# EAGLE design USB Experiment Board (EAGLE 9.6.2)
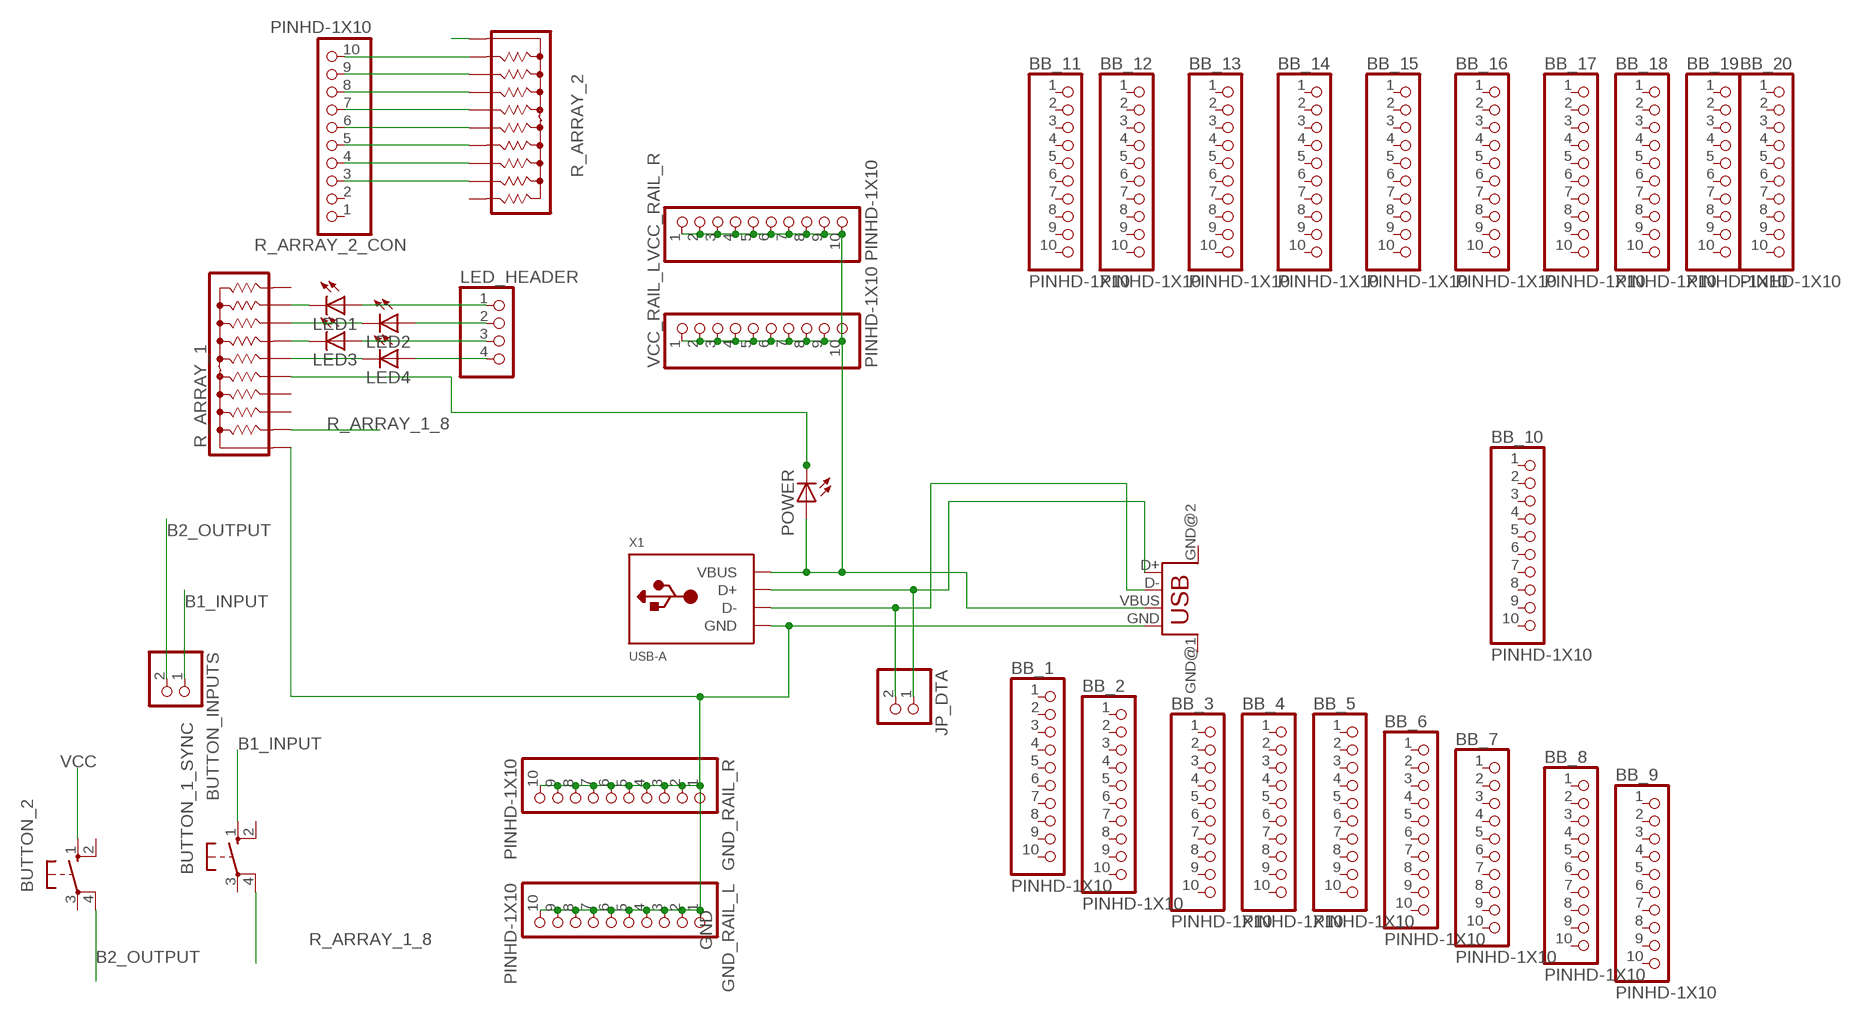
[diagram p0: schematic, sheet 1]

## Parts
BB_1  PINHD-1X10  [1X10-BIG]
BB_2  PINHD-1X10  [1X10-BIG]
BB_3  PINHD-1X10  [1X10-BIG]
BB_4  PINHD-1X10  [1X10-BIG]
BB_5  PINHD-1X10  [1X10-BIG]
BB_6  PINHD-1X10  [1X10-BIG]
BB_7  PINHD-1X10  [1X10-BIG]
BB_8  PINHD-1X10  [1X10-BIG]
BB_9  PINHD-1X10  [1X10-BIG]
BB_10  PINHD-1X10  [1X10-BIG]
BB_11  PINHD-1X10  [1X10-BIG]
BB_12  PINHD-1X10  [1X10-BIG]
BB_13  PINHD-1X10  [1X10-BIG]
BB_14  PINHD-1X10  [1X10-BIG]
BB_15  PINHD-1X10  [1X10-BIG]
BB_16  PINHD-1X10  [1X10-BIG]
BB_17  PINHD-1X10  [1X10-BIG]
BB_18  PINHD-1X10  [1X10-BIG]
BB_19  PINHD-1X10  [1X10-BIG]
BB_20  PINHD-1X10  [1X10-BIG]
BUTTON_1_SYNC  10-XX  [B3F-10XX]
BUTTON_2  10-XX  [B3F-10XX]
BUTTON_INPUTS  PINHD-1X2  [1X02]
GND_RAIL_L  PINHD-1X10  [1X10-BIG]
GND_RAIL_R  PINHD-1X10  [1X10-BIG]
JP_DTA  PINHD-1X2  [1X02]
LED1  LEDSMT1206  [1206]
LED2  LEDSMT1206  [1206]
LED3  LEDSMT1206  [1206]
LED4  LEDSMT1206  [1206]
LED_HEADER  PINHD-1X4  [1X04]
POWER  LEDSMT1206  [1206]
R_ARRAY_1  4610X  [SIP10]
R_ARRAY_2  4610X  [SIP10]
R_ARRAY_2_CON  PINHD-1X10  [1X10-BIG]
U$1  USB  [USB-FEMALE-A-PTH]
VCC_RAIL_L  PINHD-1X10  [1X10-BIG]
VCC_RAIL_R  PINHD-1X10  [1X10-BIG]
X1  USB-A  [MOLEX_480371000]

## Nets
B1_INPUT: BUTTON_1_SYNC.1(S) BUTTON_INPUTS.1
B2_OUTPUT: BUTTON_2.4(P1) BUTTON_INPUTS.2
GND: GND_RAIL_L.1 GND_RAIL_L.2 GND_RAIL_L.3 GND_RAIL_L.4 GND_RAIL_L.5 GND_RAIL_L.6 GND_RAIL_L.7 GND_RAIL_L.8 GND_RAIL_L.9 GND_RAIL_L.10 GND_RAIL_R.1 GND_RAIL_R.2 GND_RAIL_R.3 GND_RAIL_R.4 GND_RAIL_R.5 GND_RAIL_R.6 GND_RAIL_R.7 GND_RAIL_R.8 GND_RAIL_R.9 GND_RAIL_R.10 R_ARRAY_1.1 R_ARRAY_2.1 U$1.GND X1.4(GND)
N$1: R_ARRAY_2.2 R_ARRAY_2_CON.10
N$2: LED1.C R_ARRAY_1.9
N$3: JP_DTA.1 U$1.D+ X1.3(D+)
N$4: JP_DTA.2 U$1.D- X1.2(D-)
N$5: LED2.C R_ARRAY_1.8
N$6: LED3.C R_ARRAY_1.7
N$7: LED4.C R_ARRAY_1.6
N$8: LED1.A LED_HEADER.1
N$9: LED2.A LED_HEADER.2
N$10: LED3.A LED_HEADER.3
N$11: LED4.A LED_HEADER.4
N$12: R_ARRAY_2.3 R_ARRAY_2_CON.9
N$13: POWER.C R_ARRAY_1.5
N$14: R_ARRAY_2.4 R_ARRAY_2_CON.8
N$15: R_ARRAY_2.5 R_ARRAY_2_CON.7
N$16: R_ARRAY_2.6 R_ARRAY_2_CON.6
N$17: R_ARRAY_2.7 R_ARRAY_2_CON.5
N$18: R_ARRAY_2.8 R_ARRAY_2_CON.4
N$19: R_ARRAY_2.9 R_ARRAY_2_CON.3
R_ARRAY_1_8: BUTTON_1_SYNC.4(P1) R_ARRAY_1.2
VCC: BUTTON_2.1(S) POWER.A U$1.VBUS VCC_RAIL_L.1 VCC_RAIL_L.2 VCC_RAIL_L.3 VCC_RAIL_L.4 VCC_RAIL_L.5 VCC_RAIL_L.6 VCC_RAIL_L.7 VCC_RAIL_L.8 VCC_RAIL_L.9 VCC_RAIL_L.10 VCC_RAIL_R.1 VCC_RAIL_R.2 VCC_RAIL_R.3 VCC_RAIL_R.4 VCC_RAIL_R.5 VCC_RAIL_R.6 VCC_RAIL_R.7 VCC_RAIL_R.8 VCC_RAIL_R.9 VCC_RAIL_R.10 X1.1(VBUS)
Unconnected: BB_1.1 BB_1.2 BB_1.3 BB_1.4 BB_1.5 BB_1.6 BB_1.7 BB_1.8 BB_1.9 BB_1.10 BB_2.1 BB_2.2 BB_2.3 BB_2.4 BB_2.5 BB_2.6 BB_2.7 BB_2.8 BB_2.9 BB_2.10 BB_3.1 BB_3.2 BB_3.3 BB_3.4 BB_3.5 BB_3.6 BB_3.7 BB_3.8 BB_3.9 BB_3.10 BB_4.1 BB_4.2 BB_4.3 BB_4.4 BB_4.5 BB_4.6 BB_4.7 BB_4.8 BB_4.9 BB_4.10 BB_5.1 BB_5.2 BB_5.3 BB_5.4 BB_5.5 BB_5.6 BB_5.7 BB_5.8 BB_5.9 BB_5.10 BB_6.1 BB_6.2 BB_6.3 BB_6.4 BB_6.5 BB_6.6 BB_6.7 BB_6.8 BB_6.9 BB_6.10 BB_7.1 BB_7.2 BB_7.3 BB_7.4 BB_7.5 BB_7.6 BB_7.7 BB_7.8 BB_7.9 BB_7.10 BB_8.1 BB_8.2 BB_8.3 BB_8.4 BB_8.5 BB_8.6 BB_8.7 BB_8.8 BB_8.9 BB_8.10 BB_9.1 BB_9.2 BB_9.3 BB_9.4 BB_9.5 BB_9.6 BB_9.7 BB_9.8 BB_9.9 BB_9.10 BB_10.1 BB_10.2 BB_10.3 BB_10.4 BB_10.5 BB_10.6 BB_10.7 BB_10.8 BB_10.9 BB_10.10 BB_11.1 BB_11.2 BB_11.3 BB_11.4 BB_11.5 BB_11.6 BB_11.7 BB_11.8 BB_11.9 BB_11.10 BB_12.1 BB_12.2 BB_12.3 BB_12.4 BB_12.5 BB_12.6 BB_12.7 BB_12.8 BB_12.9 BB_12.10 BB_13.1 BB_13.2 BB_13.3 BB_13.4 BB_13.5 BB_13.6 BB_13.7 BB_13.8 BB_13.9 BB_13.10 BB_14.1 BB_14.2 BB_14.3 BB_14.4 BB_14.5 BB_14.6 BB_14.7 BB_14.8 BB_14.9 BB_14.10 BB_15.1 BB_15.2 BB_15.3 BB_15.4 BB_15.5 BB_15.6 BB_15.7 BB_15.8 BB_15.9 BB_15.10 BB_16.1 BB_16.2 BB_16.3 BB_16.4 BB_16.5 BB_16.6 BB_16.7 BB_16.8 BB_16.9 BB_16.10 BB_17.1 BB_17.2 BB_17.3 BB_17.4 BB_17.5 BB_17.6 BB_17.7 BB_17.8 BB_17.9 BB_17.10 BB_18.1 BB_18.2 BB_18.3 BB_18.4 BB_18.5 BB_18.6 BB_18.7 BB_18.8 BB_18.9 BB_18.10 BB_19.1 BB_19.2 BB_19.3 BB_19.4 BB_19.5 BB_19.6 BB_19.7 BB_19.8 BB_19.9 BB_19.10 BB_20.1 BB_20.2 BB_20.3 BB_20.4 BB_20.5 BB_20.6 BB_20.7 BB_20.8 BB_20.9 BB_20.10 BUTTON_1_SYNC.2(S1) BUTTON_1_SYNC.3(P) BUTTON_2.2(S1) BUTTON_2.3(P) R_ARRAY_1.3 R_ARRAY_1.4 R_ARRAY_1.10 R_ARRAY_2.10 R_ARRAY_2_CON.1 R_ARRAY_2_CON.2 U$1.GND@1(GND) U$1.GND@2(GND)

## Library data of the parts
BB_1-BB_20 GND_RAIL_L GND_RAIL_R R_ARRAY_2_CON VCC_RAIL_L VCC_RAIL_R = adafruit:PINHD-1X10: Pin header 1x10 0.1" spacing With round pins
BUTTON_1_SYNC BUTTON_2 = switch-omron:10-XX: OMRON SWITCH; MPN: B3F-1000; OC_FARNELL: 176432; OC_NEWARK: 36M3542
BUTTON_INPUTS JP_DTA = pinhead:PINHD-1X2: PIN HEADER
LED1-LED4 POWER = adafruit:LED: LED OSRAM: - CHIPLED LG R971, LG N971, LY N971, LG Q971, LY Q971, LO R971, LY R971 LH N974, LH R974 LS Q976, LO Q976, LY Q976 LO Q996 - Hyper CHIPLED LW Q18S LB Q993, LB Q99A, LB R99A - SideLED LS A670, LO A670, LY A670, LG A670, LP A670 LB A673, LV A673, LT A673, LW A673 LH A674 LY A675 LS A676, LA A676, LO A676, LY A676, LW A676 LS A679, LY A679, LG A679 - Hyper Micro SIDELED® LS Y876, LA Y876, LO Y876, LY Y876 LT Y87S - SmartLED LW L88C, LW L88S LB L89C, LB L89S, LG L890 LS L89K, LO L89K, LY L89K LS L896, LA L896, LO L896, LY L896 - TOPLED LS T670, LO T670, LY T670, LG T670, LP T670 LSG T670, LSP T670, LSY T670, LOP T670, LYG T670 LG T671, LOG T671, LSG T671 LB T673, LV T673, LT T673, LW T673 LH T674 LS T676, LA T676, LO T676, LY T676, LB T676, LH T676, LSB T676, LW T676 LB T67C, LV T67C, LT T67C, LS T67K, LO T67K, LY T67K, LW E67C LS E67B, LA E67B, LO E67B, LY E67B, LB E67C, LV E67C, LT E67C LW T67C LS T679, LY T679, LG T679 LS T770, LO T770, LY T770, LG T770, LP T770 LB T773, LV T773, LT T773, LW T773 LH T774 LS E675, LA E675, LY E675, LS T675 LS T776, LA T776, LO T776, LY T776, LB T776 LHGB T686 LT T68C, LB T68C - Hyper Mini TOPLED® LB M676 - Mini TOPLED Santana® LG M470 LS M47K, LO M47K, LY M47K Source: http://www.osram.convergy.de/
LED_HEADER = pinhead:PINHD-1X4: PIN HEADER
R_ARRAY_1 R_ARRAY_2 = resistor-sip:4610X: Bourns 4600X Series - Thick Film Conformal SIPs 4610X-101 Resistor Network Configuration: 101 (Bussed Resistors) Resistance range: 10 ohms to 10 Megaohms Maximum Operating Voltage: 100V Source: http://www.bourns.com/ProductLine.aspx?name=standard_thick_film_networks PDF: http://www.bourns.com/data/global/pdfs/4600X.pdf
U$1 = STUNTAZ:USB: USB Connectors USB-FEMALE-A-PTH: Through hole Female Type A Connector
X1 = adafruit:USB-A: USB type A 'plug' Used for things that can directly connect to a USB port, say USB key

## Board
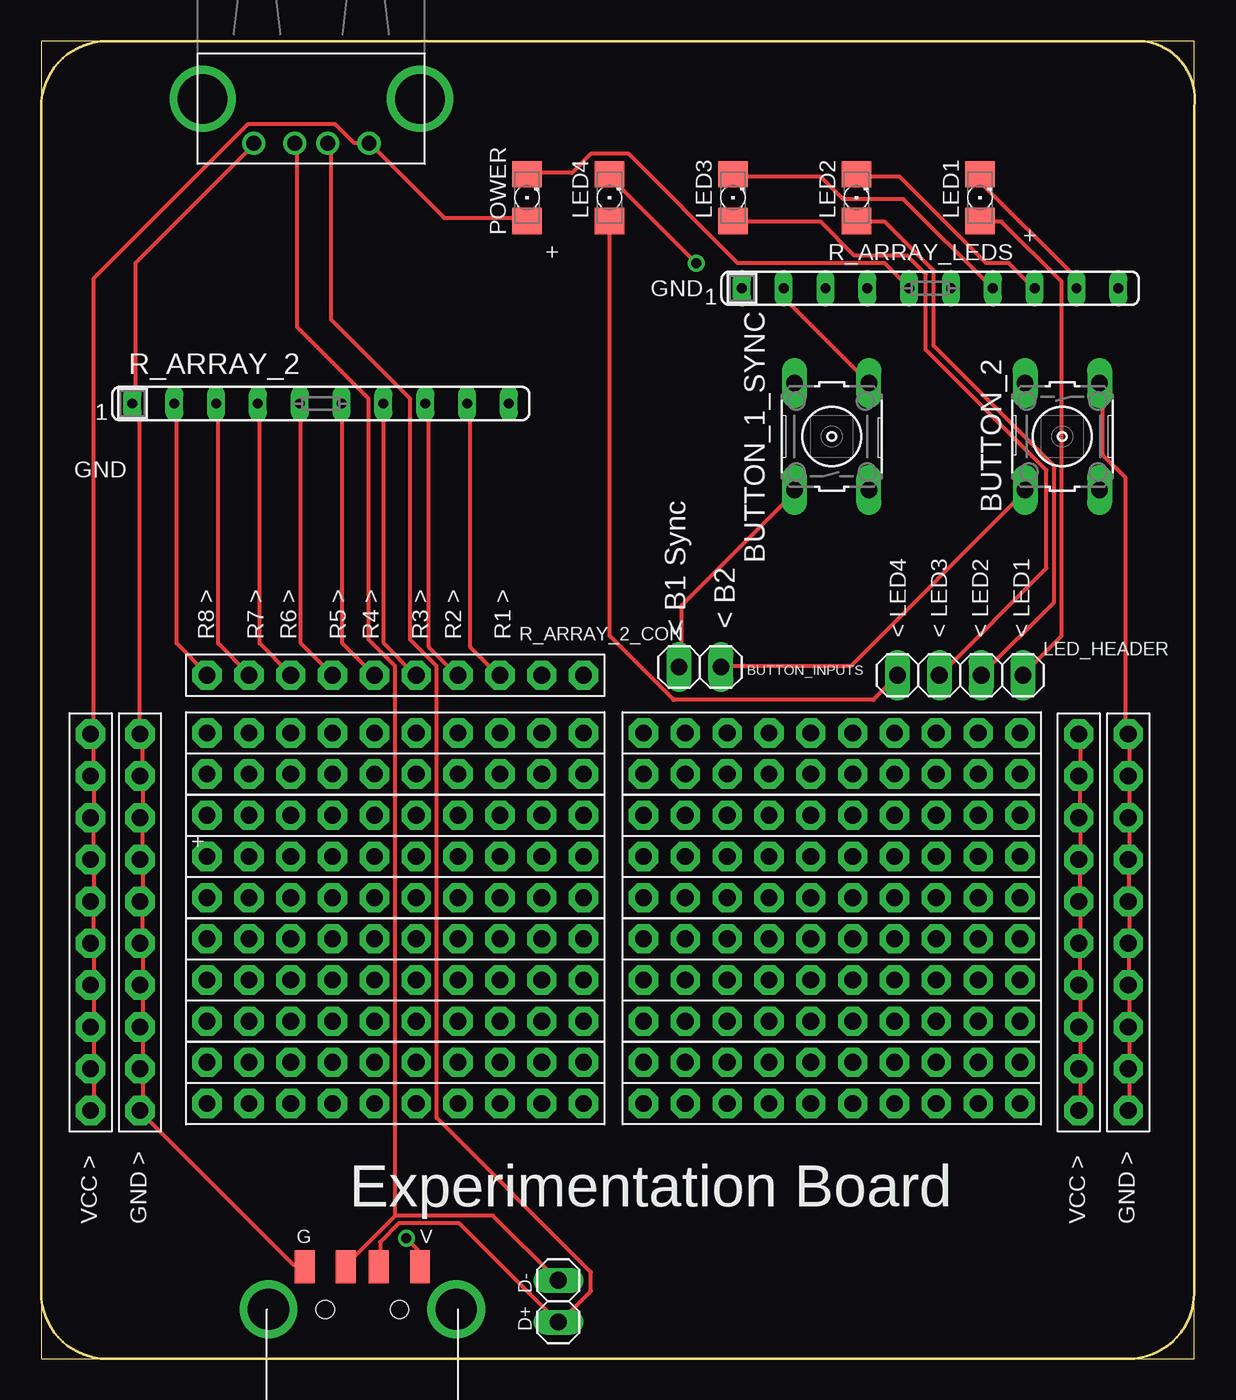
[diagram p1: board, top side]
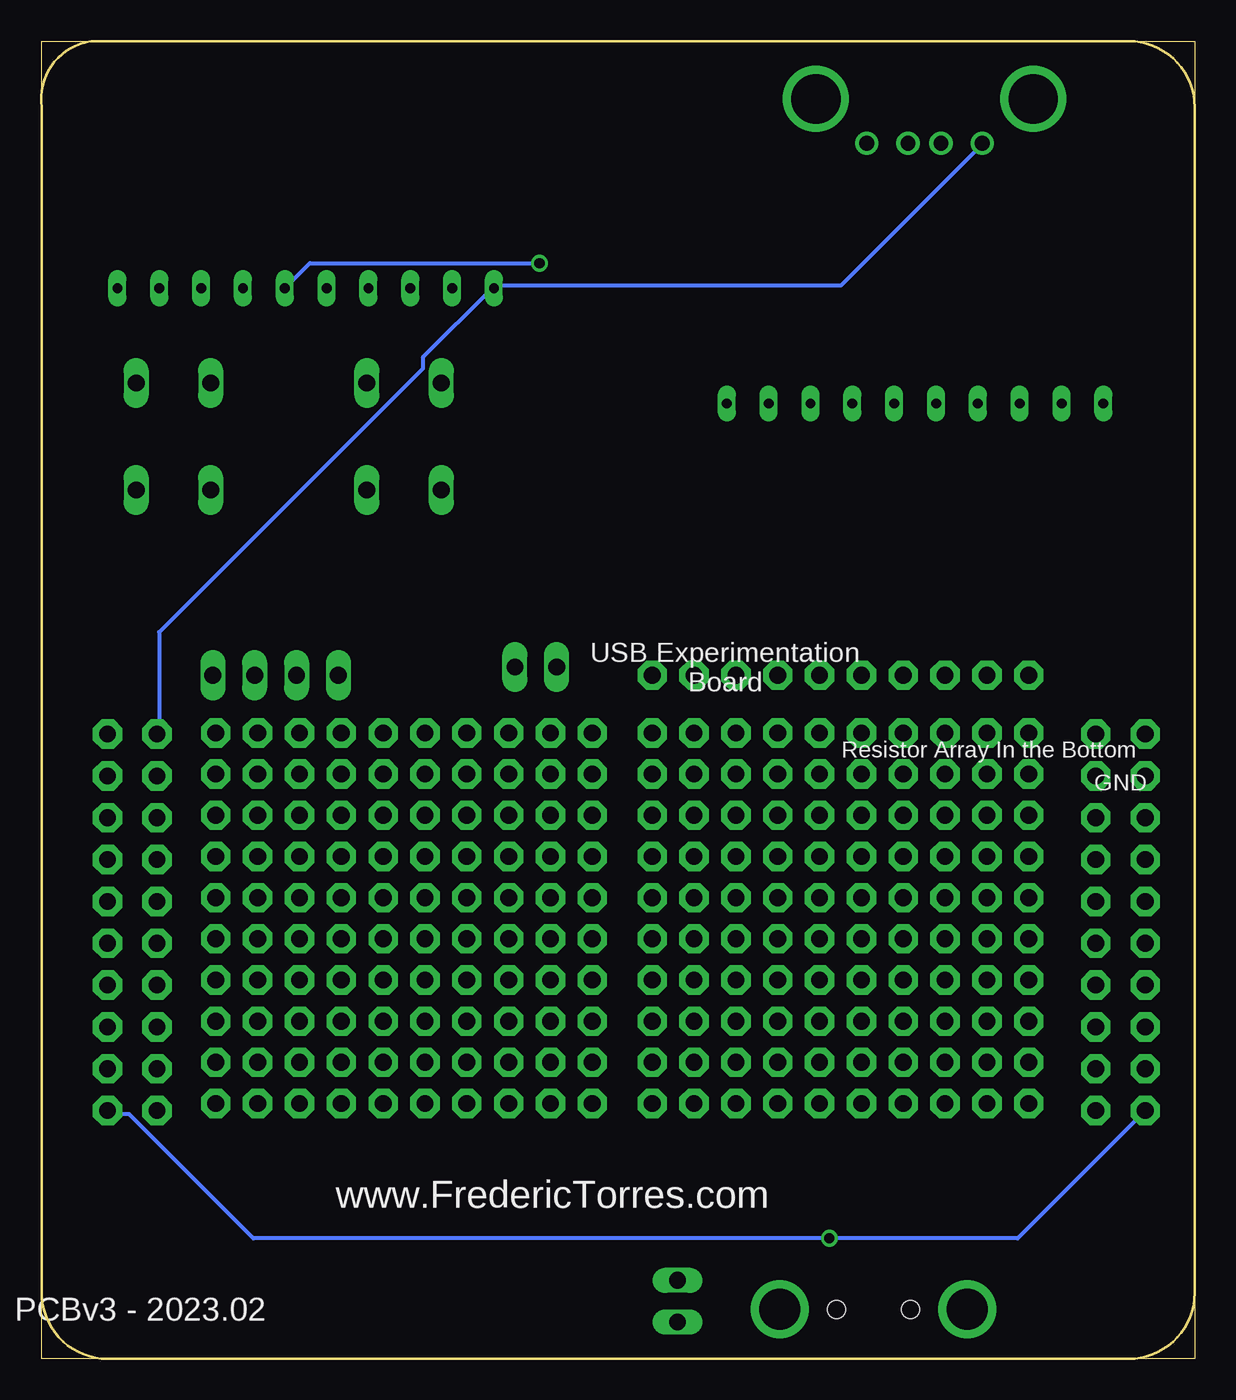
[diagram p2: board, bottom side, seen from below]

Size 70.03 x 80 mm. Coordinates in mm from the lower left corner, seen from the top.
Outline: 4,0 0,0 0,4
Outline: 66,0 70,0 70,29
Outline: 70,76 70,80 67,80
Outline: 4,80 0,80 0,76
Outline: 0,76 arc-90 4,80
Outline: 0,76 0,4
Outline: 0,4 arc90 4,0
Outline: 4,0 66,0
Outline: 66,0 arc90 70,4 70,29
Outline: 70,29 70,76
Outline: 70,76 arc90 67,80
Outline: 67,80 4,80
Copper layers (1*16): Top 0.035mm / dielectric 1.5mm / Bottom 0.035mm
Design rules "default": minimum track width 10mil, minimum drill 24mil, track to track 8mil, track to pad 8mil, pad to pad 8mil, via to via 8mil, smd to smd 8mil, copper to edge 40mil, drill to drill 8mil, minimum pad ring 10mil, minimum via ring 8mil, stop-mask expansion 4mil, vias tented up to drill 0mil, thermal gap 10mil

### Footprints (pad centres in the part's own frame; a part is rotated, then mirrored left to right if it is on the bottom)
1X10-BIG = drill 1.016 pad 1.778 octagon: 1 -11.43,0; 2 -8.89,0; 3 -6.35,0; 4 -3.81,0; 5 -1.27,0; 6 1.27,0; 7 3.81,0; 8 6.35,0; 9 8.89,0; 10 11.43,0
B3F-10XX = drill 1.016 long: 1 -3.251,2.261; 2 3.251,2.261; 3 -3.251,-2.261; 4 3.251,-2.261
1X02 = drill 1.016 long: 1 -1.27,0; 2 1.27,0
1206 = smd 1.6 x 1.803: A -1.422,0; C 1.422,0
1X04 = drill 1.016 long: 1 -3.81,0; 2 -1.27,0; 3 1.27,0; 4 3.81,0
SIP10 = drill 0.6 long: 1 -11.46,0; 2 -8.92,0; 3 -6.38,0; 4 -3.84,0; 5 -1.3,0; 6 1.24,0; 7 3.78,0; 8 6.32,0; 9 8.86,0; 10 11.4,0
USB-FEMALE-A-PTH = drill 0.9: D+ 5.9,1.3; D- 7.9,1.3; GND 3.4,1.3; VBUS 10.4,1.3 | drill 3: GND@1 13.5,4; GND@2 0.3,4
MOLEX_480371000 = smd 1.2 x 2: 1 3.5,2.6; 2 1,2.6; 3 -1,2.6; 4 -3.5,2.6 | drill 2.5: M1 -5.7,0; M2 5.7,0 | hole 1.1: -2.25,0; 2.25,0

### Placement (x,y rotation side)
BB_1  21.5,15.5 0 top
BB_2  21.5,18 0 top
BB_3  21.5,20.5 0 top
BB_4  21.5,23 0 top
BB_5  21.5,25.5 0 top
BB_6  21.5,28 0 top
BB_7  21.5,33 0 top
BB_8  21.5,30.5 0 top
BB_9  21.5,35.5 0 top
BB_10  21.5,38 0 top
BB_11  48,23 180 top
BB_12  48,18 180 top
BB_13  48,15.5 180 top
BB_14  48,38 0 top
BB_15  48,20.5 180 top
BB_16  48,35.5 180 top
BB_17  48,25.5 180 top
BB_18  48,28 180 top
BB_19  48,33 180 top
BB_20  48,30.5 180 top
BUTTON_1_SYNC  48,56 90 top
BUTTON_2  62,56 270 top
BUTTON_INPUTS  40,42 0 top
GND_RAIL_L  6,26.5 90 top
GND_RAIL_R  63,26.5 90 top
JP_DTA  31.4,3.5 270 top
LED1  57,70.5 90 top
LED2  49.5,70.5 90 top
LED3  42,70.5 90 top
LED4  34.5,70.5 90 top
LED_HEADER  55.8,41.5 180 top
POWER  29.5,70.5 90 top
R_ARRAY_1  54,65 0 top
R_ARRAY_2  17,58 0 top
R_ARRAY_2_CON  21.5,41.5 180 top
U$1  9.5,72.5 0 top
VCC_RAIL_L  3,26.5 90 top
VCC_RAIL_R  66,26.5 90 top
X1  19.5,3 0 top

### Tracks (layer width: path | path; a pad name or v marks a point on that pad's centre or on a via)
B1_INPUT
  Top 0.254: BUTTON_INPUTS.1 38.86,42.06 38.86,45.72 45.72,52.58 BUTTON_1_SYNC.1
B2_OUTPUT
  Top 0.254: BUTTON_INPUTS.2 41.38,42.06 49.15,42.06 59.66,52.58 BUTTON_2.4
GND
  Top 0.254: X1.4 15.77,5.71 15.32,5.71 6.17,14.86 GND_RAIL_L.1 6.17,15.09 6.17,17.6 GND_RAIL_L.2 6.17,17.83 6.17,20.12 GND_RAIL_L.3 6.17,20.34 6.17,22.63 GND_RAIL_L.4 6.17,22.86 6.17,25.15 GND_RAIL_L.5 6.17,25.38 6.17,27.66 GND_RAIL_L.6 6.17,27.89 6.17,30.18 GND_RAIL_L.7 6.17,30.4 6.17,32.69 GND_RAIL_L.8 6.17,32.92 6.17,35.2 GND_RAIL_L.9 6.17,35.43 6.17,37.72 GND_RAIL_L.10 5.94,37.95 5.94,57.61 5.71,57.84 R_ARRAY_2.1 5.71,58.06 5.71,66.52 12.8,73.61 U$1.GND | GND_RAIL_R.10 63.09,37.72 63.09,35.43 GND_RAIL_R.9 63.09,35.2 63.09,32.92 GND_RAIL_R.8 63.09,32.69 63.09,30.4 GND_RAIL_R.7 63.09,30.18 63.09,27.89 GND_RAIL_R.6 63.09,27.66 63.09,25.38 GND_RAIL_R.5 63.09,25.15 63.09,22.86 GND_RAIL_R.4 63.09,22.63 63.09,20.34 GND_RAIL_R.3 63.09,20.12 63.09,17.83 GND_RAIL_R.2 63.09,17.6 63.09,15.09 GND_RAIL_R.1
  Bottom 0.254: U$1.GND 13.03,73.61 21.49,65.15 42.52,65.15 R_ARRAY_1.1 42.75,64.92 46.86,60.81 46.86,60.12 62.87,44.12 62.87,37.95 GND_RAIL_R.10
N$1
  Top 0.254: R_ARRAY_2.2 8.23,57.84 8.23,43.43 10.06,41.6 R_ARRAY_2_CON.10
N$2
  Top 0.254: LED1.C 57.15,71.78 57.15,71.32 62.64,65.84 62.64,65.15 R_ARRAY_1.9
N$3
  Top 0.254: 21.49,8.69 18.52,5.71 X1.3 | 21.49,8.69 27.43,8.69 31.32,4.8 JP_DTA.1 | 21.49,8.69 21.49,42.06 19.89,43.66 19.89,58.29 15.54,62.64 15.54,73.61 U$1.D+
N$4
  Top 0.254: X1.2 20.57,5.71 20.57,7.09 21.72,8.23 25.38,8.23 31.32,2.29 JP_DTA.2 31.55,2.29 33.38,4.12 33.38,5.26 24,14.63 24,42.06 22.4,43.66 22.4,58.29 17.6,63.09 17.6,73.61 U$1.D-
N$5
  Top 0.254: LED2.C 49.61,71.78 52.12,71.78 57.38,66.52 58.75,66.52 60.12,65.15 R_ARRAY_1.8
N$6
  Top 0.254: LED3.C 42.06,71.78 47.32,71.78 48.69,70.41 52.35,70.41 57.61,65.15 R_ARRAY_1.7
N$7  (via drill 0.61)
  Top 0.254: v39.78,66.52 34.52,71.78 LED4.C
  Bottom 0.254: v39.78,66.52 53.72,66.52 55.09,65.15 R_ARRAY_1.6
N$8
  Top 0.254: LED1.A 57.15,69.04 58.29,69.04 61.95,65.38 61.95,43.89 59.66,41.6 LED_HEADER.1
N$9
  Top 0.254: LED2.A 49.61,69.04 51.21,69.04 54.18,66.06 54.18,61.49 61.49,54.18 61.49,45.95 57.15,41.6 LED_HEADER.2
N$10
  Top 0.254: LED3.A 42.06,69.04 47.32,69.04 49.38,66.98 52.58,66.98 53.72,65.84 53.72,61.27 61.04,53.95 61.04,48.01 54.63,41.6 LED_HEADER.3
N$11
  Top 0.254: LED4.A 34.52,69.04 34.52,43.89 38.41,40.01 50.52,40.01 51.89,41.38 LED_HEADER.4
N$12
  Top 0.254: R_ARRAY_2.3 10.74,57.84 10.74,43.43 12.57,41.6 R_ARRAY_2_CON.9
N$13
  Top 0.254: POWER.C 29.72,72.01 32.23,72.01 33.38,73.15 35.66,73.15 42.29,66.52 51.21,66.52 52.58,65.15 R_ARRAY_1.5
N$14
  Top 0.254: R_ARRAY_2.4 13.26,57.84 13.26,43.43 15.09,41.6 R_ARRAY_2_CON.8
N$15
  Top 0.254: R_ARRAY_2.5 15.77,57.84 15.77,43.43 17.6,41.6 R_ARRAY_2_CON.7
N$16
  Top 0.254: R_ARRAY_2.6 18.29,57.84 18.29,43.43 20.12,41.6 R_ARRAY_2_CON.6
N$17
  Top 0.254: R_ARRAY_2.7 20.8,57.84 20.8,43.43 22.63,41.6 R_ARRAY_2_CON.5
N$18
  Top 0.254: R_ARRAY_2.8 23.55,57.84 23.55,43.2 25.15,41.6 R_ARRAY_2_CON.4
N$19
  Top 0.254: R_ARRAY_2.9 26.06,57.84 26.06,43.2 27.66,41.6 R_ARRAY_2_CON.3
R_ARRAY_1_8
  Top 0.254: R_ARRAY_1.2 45.26,64.92 45.26,64.24 50.06,59.44 BUTTON_1_SYNC.4
VCC  (via drill 0.61)
  Top 0.254: VCC_RAIL_R.1 66.06,15.09 66.06,17.6 VCC_RAIL_R.2 66.06,17.83 66.06,20.12 VCC_RAIL_R.3 66.06,20.34 66.06,22.63 VCC_RAIL_R.4 66.06,22.86 66.06,25.15 VCC_RAIL_R.5 66.06,25.38 66.06,27.66 VCC_RAIL_R.6 66.06,27.89 66.06,30.18 VCC_RAIL_R.7 66.06,30.4 66.06,32.69 VCC_RAIL_R.8 66.06,32.92 66.06,35.2 VCC_RAIL_R.9 66.06,35.43 66.06,37.72 VCC_RAIL_R.10 65.84,37.95 65.84,53.49 64.47,54.86 64.47,59.21 BUTTON_2.1 | v22.17,7.32 22.86,6.63 22.86,5.71 X1.1 | POWER.A 29.49,69.27 24.46,69.27 20.12,73.61 U$1.VBUS 19.89,73.84 18.97,73.84 17.83,74.98 12.57,74.98 3.2,65.61 3.2,37.95 VCC_RAIL_L.10 3.2,37.72 3.2,35.43 VCC_RAIL_L.9 3.2,35.2 3.2,32.92 VCC_RAIL_L.8 3.2,32.69 3.2,30.4 VCC_RAIL_L.7 3.2,30.18 3.2,27.89 VCC_RAIL_L.6 3.2,27.66 3.2,25.38 VCC_RAIL_L.5 3.2,25.15 3.2,22.86 VCC_RAIL_L.4 3.2,22.63 3.2,20.34 VCC_RAIL_L.3 3.2,20.12 3.2,17.83 VCC_RAIL_L.2 3.2,17.6 3.2,15.09 VCC_RAIL_L.1
  Bottom 0.254: VCC_RAIL_L.1 3.2,14.86 10.74,7.32 v22.17,7.32 57.15,7.32 64.69,14.86 65.84,14.86 VCC_RAIL_R.1

### Text on the board
tNames: + | + | R_ARRAY_LEDS | GND | GND | < B1 Sync | < B2 | < LED4 | < LED3 | < LED2 | < LED1 | R8 > | R7 > | R6 > | R5 > | R4 > | R3 > | R2 > | R1 > | + | Experimentation Board | VCC > | GND > | VCC > | GND > | G | V | D- | D+
bNames: USB Experimentation / Board | Resistor Array In the Bottom | GND | www.FredericTorres.com | PCBv3 - 2023.02